# EAGLE board CSv2_exp_board (EAGLE 9.6.2)
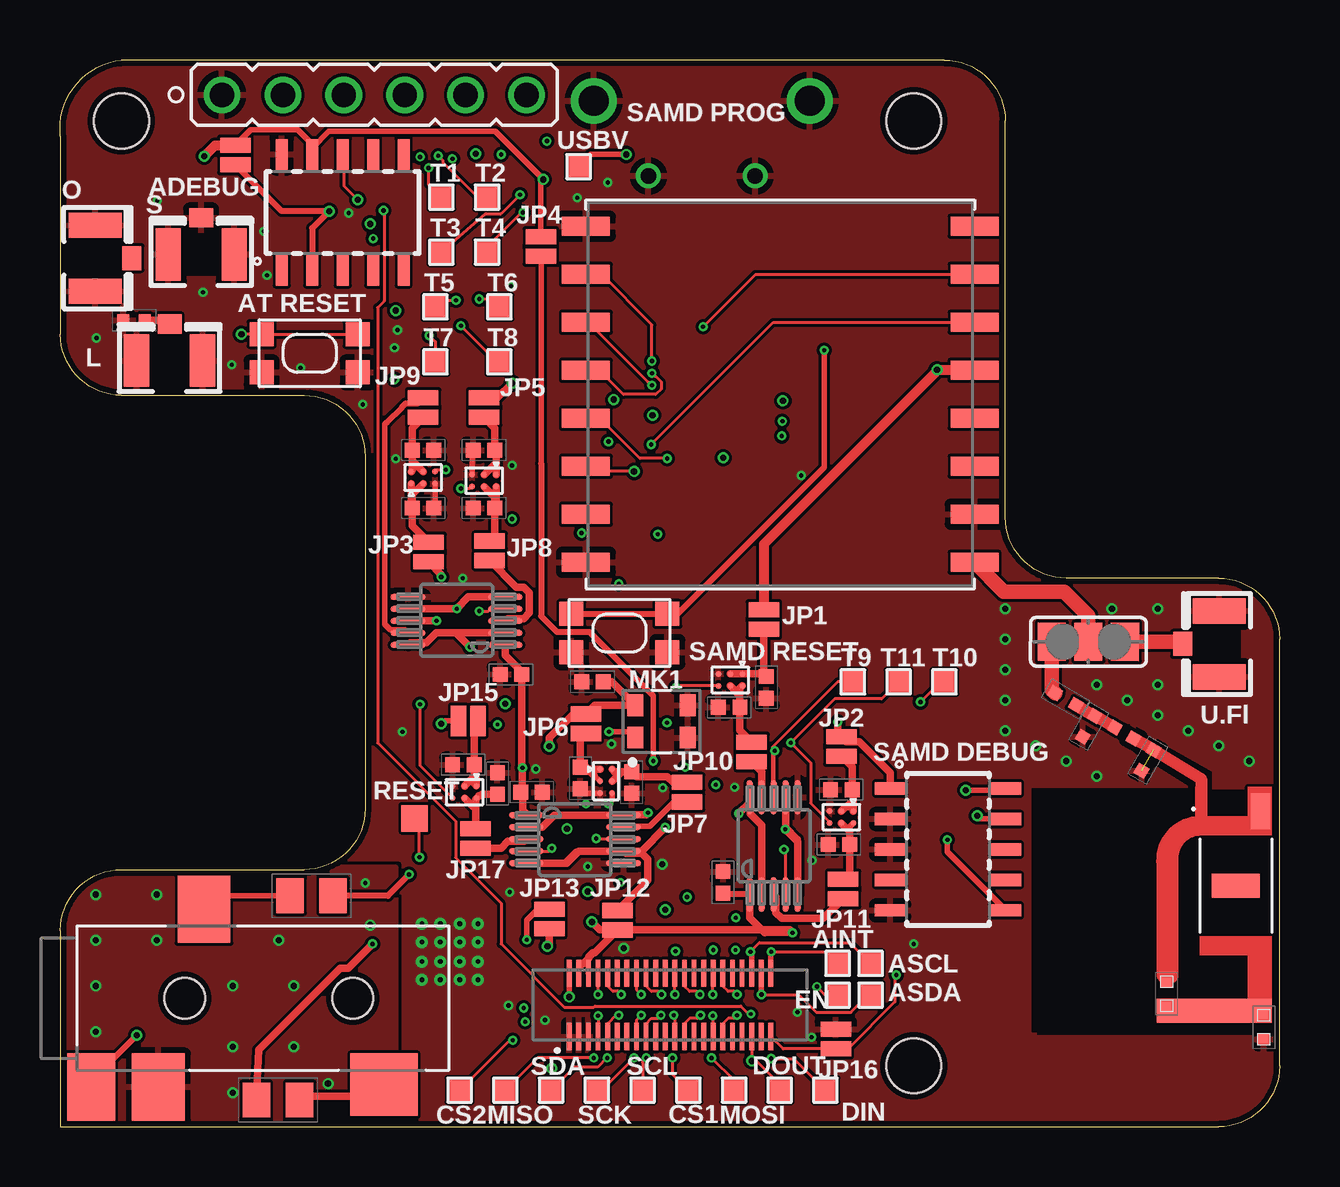
[diagram p4: board, top side]
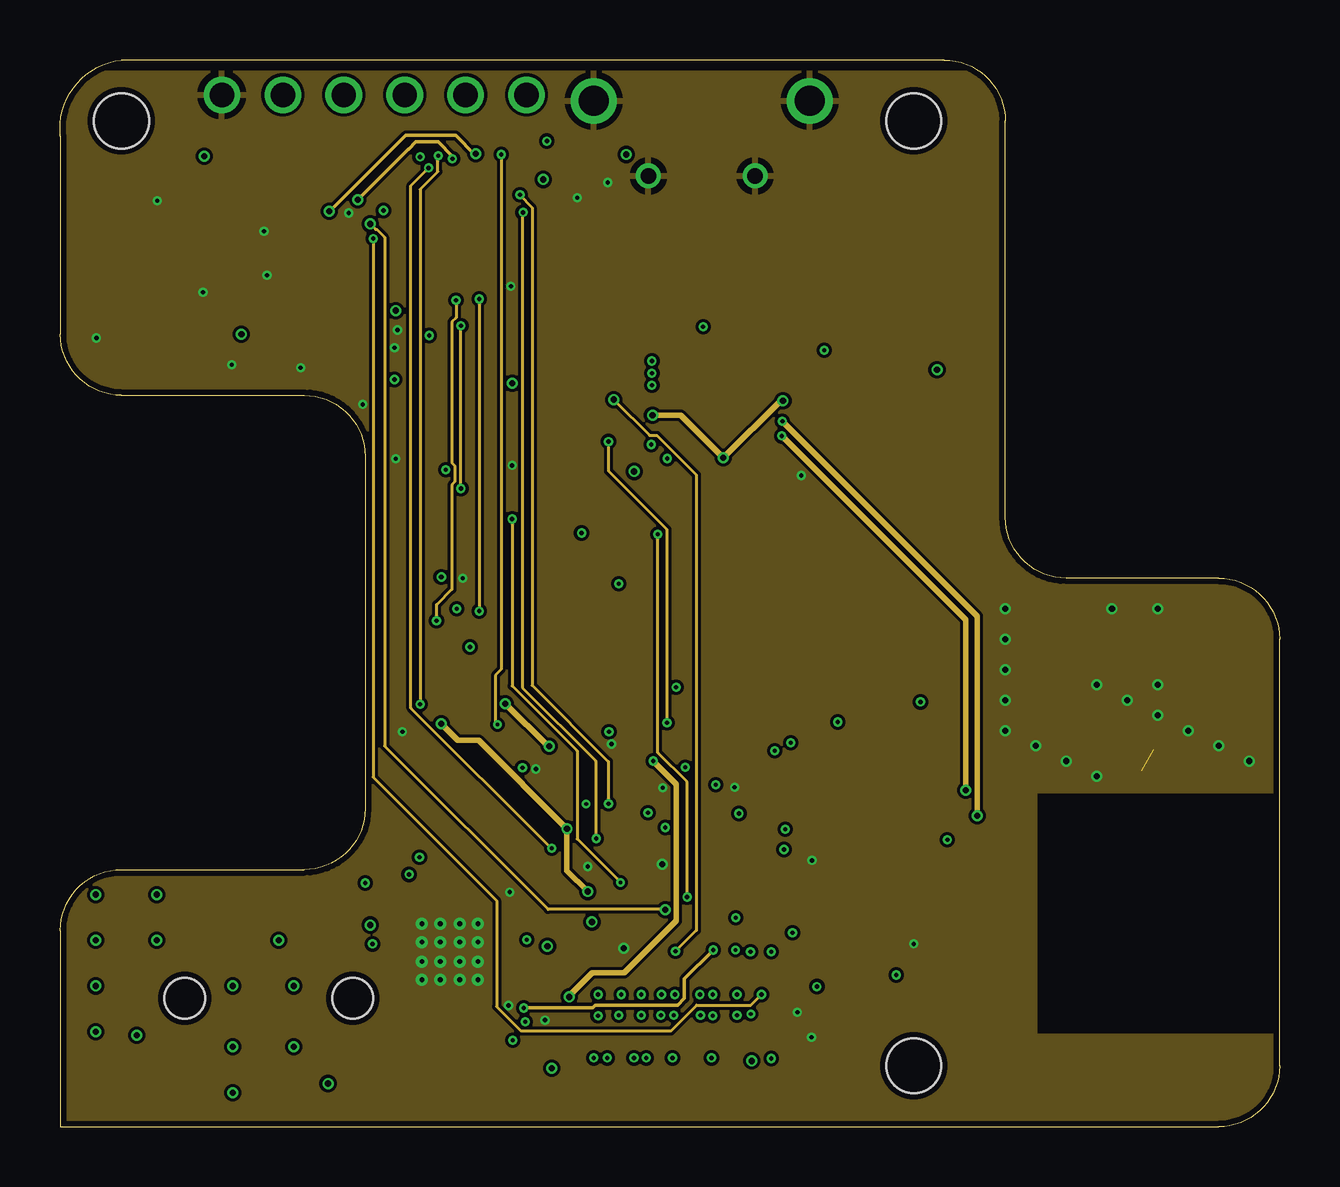
[diagram p5: board, inner layer Route2]
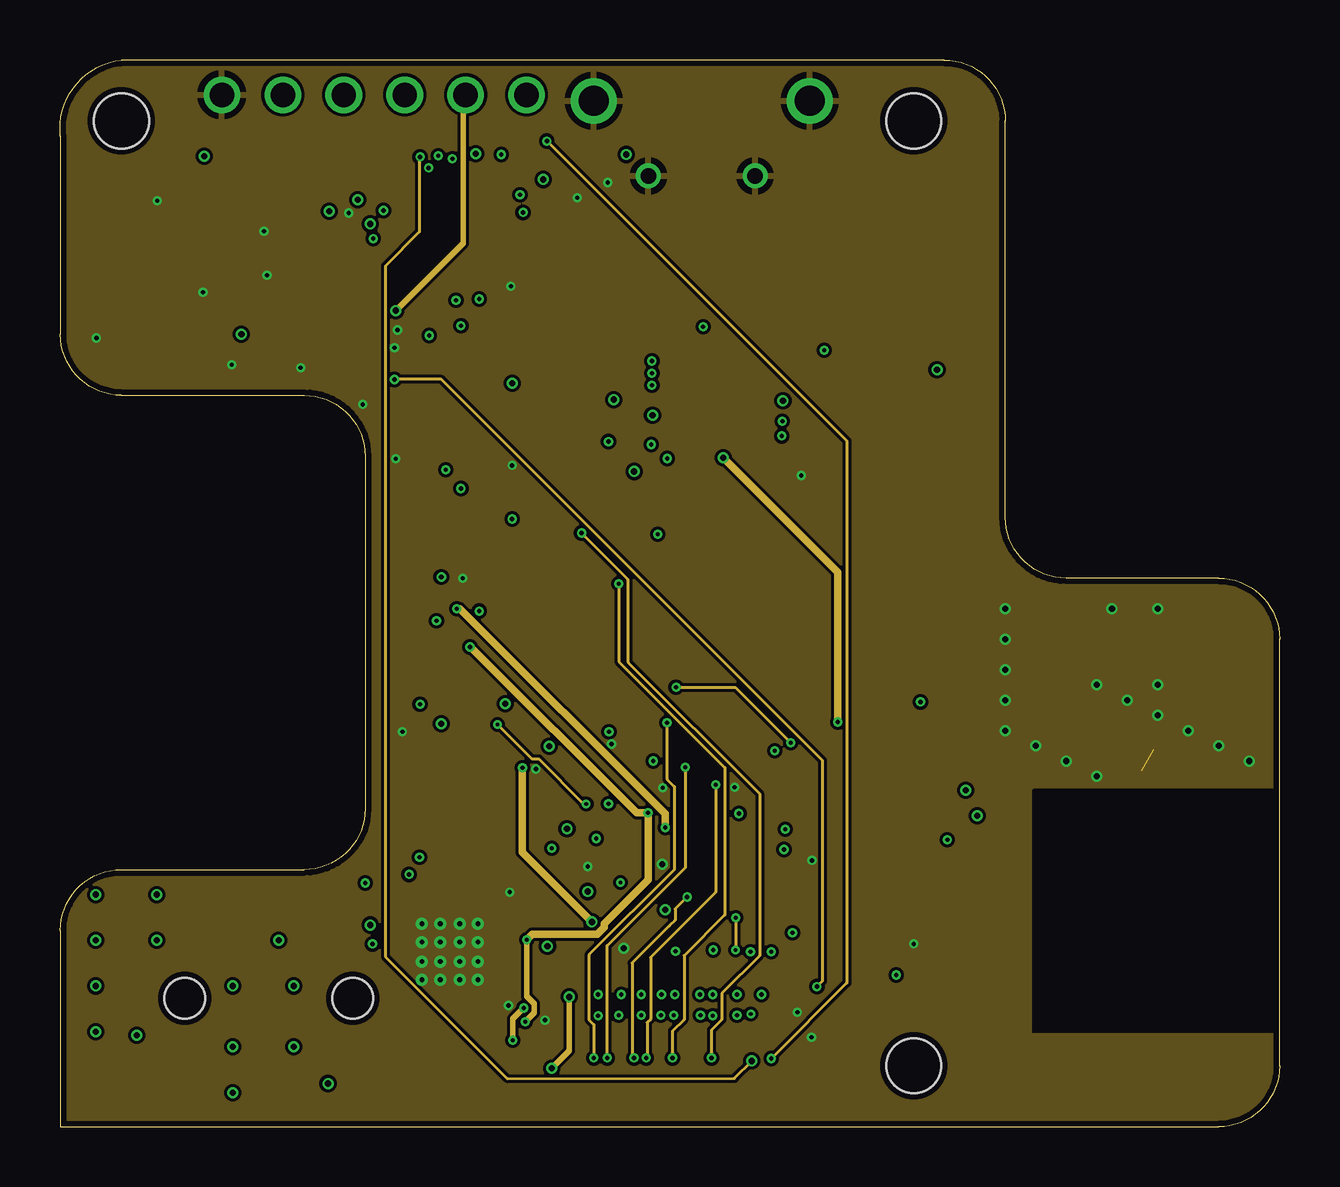
[diagram p6: board, inner layer Route15]
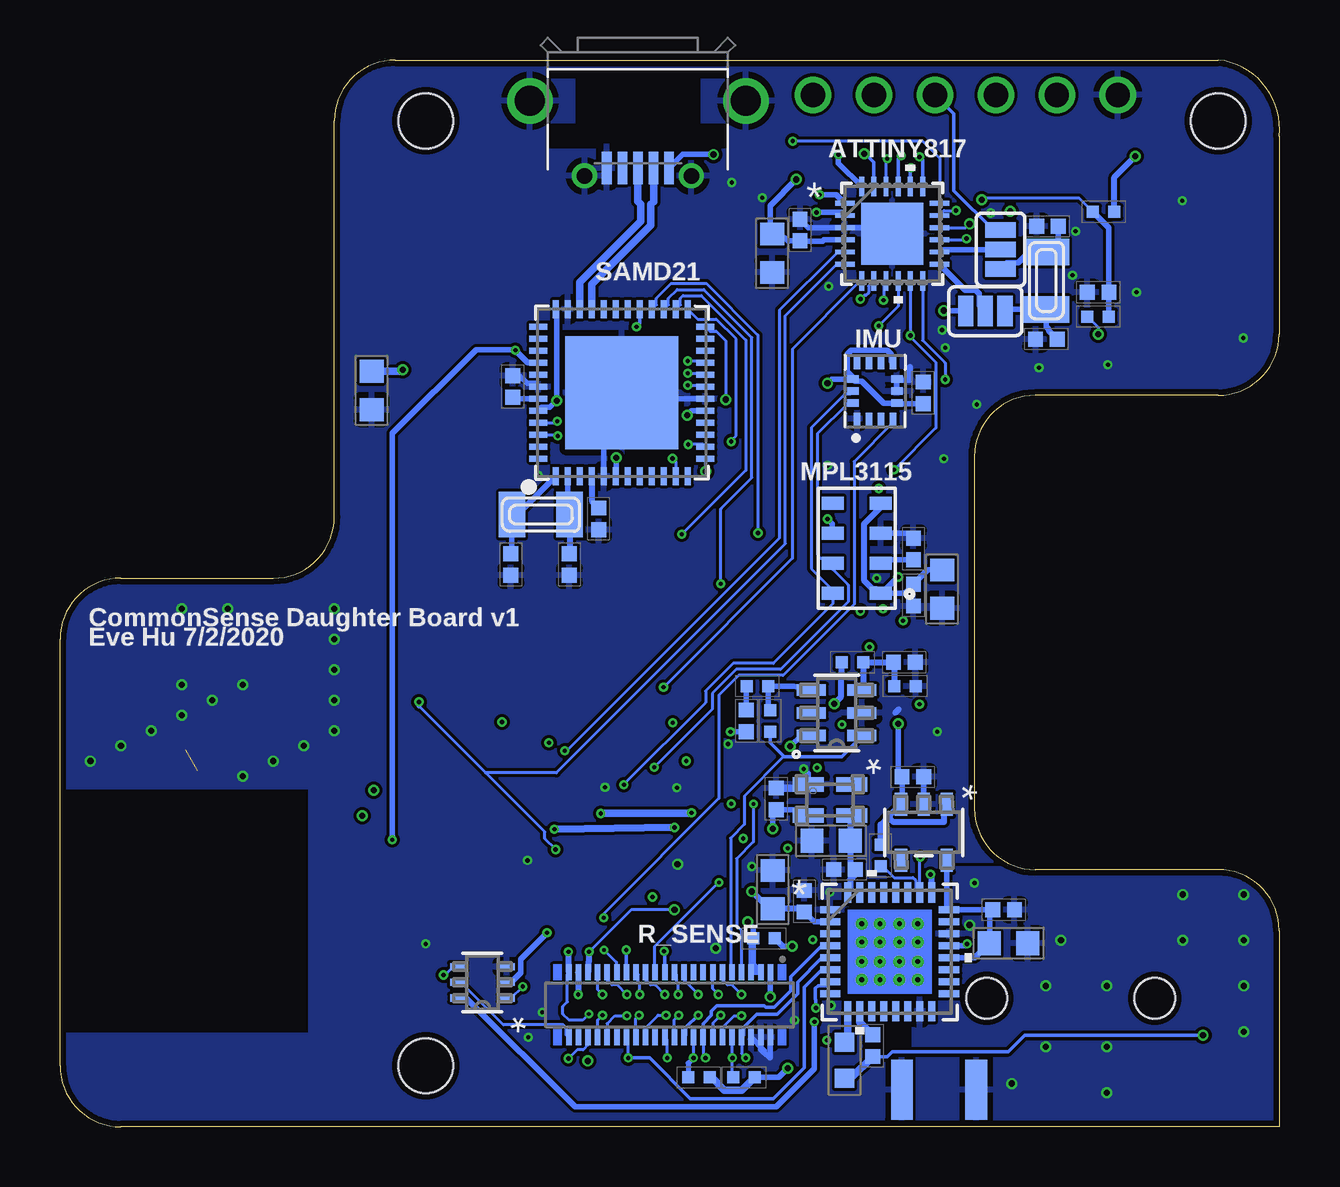
[diagram p7: board, bottom side, seen from below]

Size 50.82 x 44.45 mm. Coordinates in mm from the lower left corner, seen from the top.
Outline: 0.02,0 48.28,0 arc90 50.82,2.54 50.82,20.32 arc90 48.28,22.86 41.93,22.86 arc-90 39.39,25.4 39.39,41.91 arc90 36.85,44.45 2.56,44.45 arc90 0.02,41.27 0.02,33.02 arc90 2.56,30.48 10.18,30.48 arc-90 12.72,27.94 12.72,13.26 arc-90 10.18,10.72 2.56,10.72 arc90 0.02,8.18 0.02,0
Copper layers (1+2*15+16): Top 0.001778125mm / dielectric 0.231140625mm / Route2 0.01778125mm / dielectric 0.929640625mm / Route15 0.01778125mm / dielectric 0.231140625mm / Bottom 0.01778125mm
Design rules "CSv2_bittele_4-layer *": minimum track width 4mil, minimum drill 6mil, track to track 4mil, track to pad 4mil, pad to pad 4mil, via to via 4mil, smd to smd 4mil, copper to edge 10mil, drill to drill 5mil, minimum pad ring 4mil, minimum via ring 4mil, stop-mask expansion 4mil, vias tented up to drill 0mil, thermal gap 10mil
Net classes: 0 default: width 0.127 mm, drill 0.152 mm, clearance 0.127 mm; 1 power: width 0.229 mm, drill 0.178 mm, clearance 0.127 mm; 2 diff_pair: width 0.229 mm; 3 12mil: width 0.305 mm, drill 0.33 mm; 8 GND: width 0.127 mm
Holes 2.29 mm at 35.58,2.54 2.56,41.91 35.58,41.91

## Footprints (pad centres in the part's own frame; a part is rotated, then mirrored left to right if it is on the bottom)
ILA_09_CHIP_ANTENNA = smd 1.5 x 0.8: G1 -3.11,1.02 | smd 1 x 4.8: G2 5.2,-0.9 | smd 1 x 2: NC 0,0
TP10SQ = smd 1 x 1: TP 0,0
C0402 = smd 0.62 x 0.62: 1 -0.45,0; 2 0.45,0
C0402-S = smd 0.5 x 0.5: 1 -0.5,0; 2 0.5,0
C0603 = smd 0.95 x 1: 1 -0.8,0; 2 0.8,0
C0805 = smd 1.15 x 1.45: 1 -0.9,0; 2 0.9,0
HRS_DF40HC(3.0)-44DS-0.4V(51) = smd 0.2 x 1.14: 1 -4.2,-1.32; 2 -4.2,1.32; 3 -3.8,-1.32; 4 -3.8,1.32; 5 -3.4,-1.32; 6 -3.4,1.32; 7 -3,-1.32; 8 -3,1.32; 9 -2.6,-1.32; 10 -2.6,1.32; 11 -2.2,-1.32; 12 -2.2,1.32; 13 -1.8,-1.32; 14 -1.8,1.32; 15 -1.4,-1.32; 16 -1.4,1.32; 17 -1,-1.32; 18 -1,1.32; 19 -0.6,-1.32; 20 -0.6,1.32; 21 -0.2,-1.32; 22 -0.2,1.32; 23 0.2,-1.32; 24 0.2,1.32; 25 0.6,-1.32; 26 0.6,1.32; 27 1,-1.32; 28 1,1.32; 29 1.4,-1.32; 30 1.4,1.32; 31 1.8,-1.32; 32 1.8,1.32; 33 2.2,-1.32; 34 2.2,1.32; 35 2.6,-1.32; 36 2.6,1.32; 37 3,-1.32; 38 3,1.32; 39 3.4,-1.32; 40 3.4,1.32; 41 3.8,-1.32; 42 3.8,1.32; 43 4.2,-1.32; 44 4.2,1.32
HEADER-1X6 = drill 1.016: 1 0,-6.35; 2 0,-3.81; 3 0,-1.27; 4 0,1.27; 5 0,3.81; 6 0,6.35
SAMTECH_FTSH-105-01 = smd 0.508 x 1.27: 1 -2.54,-2.413; 2 -2.54,2.413; 3 -1.27,-2.413; 4 -1.27,2.413; 5 0,-2.413; 6 0,2.413; 7 1.27,-2.413; 8 1.27,2.413; 9 2.54,-2.413; 10 2.54,2.413
CUI_SJ-43514-SMT-TEMP = smd 2 x 2.8: 1 -7.15,-3.7 | smd 2.8 x 2.6: 2 5.05,-3.6 | smd 2.2 x 2.8: 3 -2.45,3.7; 4 -4.35,-3.7 | hole 1.7: -3.25,0; 3.75,0
HRS_DF40C-44DP-0.4V(51) = smd 0.23 x 0.66: 1 -4.2,1.355; 2 -4.2,-1.355; 3 -3.8,1.355; 4 -3.8,-1.355; 5 -3.4,1.355; 6 -3.4,-1.355; 7 -3,1.355; 8 -3,-1.355; 9 -2.6,1.355; 10 -2.6,-1.355; 11 -2.2,1.355; 12 -2.2,-1.355; 13 -1.8,1.355; 14 -1.8,-1.355; 15 -1.4,1.355; 16 -1.4,-1.355; 17 -1,1.355; 18 -1,-1.355; 19 -0.6,1.355; 20 -0.6,-1.355; 21 -0.2,1.355; 22 -0.2,-1.355; 23 0.2,1.355; 24 0.2,-1.355; 25 0.6,1.355; 26 0.6,-1.355; 27 1,1.355; 28 1,-1.355; 29 1.4,1.355; 30 1.4,-1.355; 31 1.8,1.355; 32 1.8,-1.355; 33 2.2,1.355; 34 2.2,-1.355; 35 2.6,1.355; 36 2.6,-1.355; 37 3,1.355; 38 3,-1.355; 39 3.4,1.355; 40 3.4,-1.355; 41 3.8,1.355; 42 3.8,-1.355; 43 4.2,1.355; 44 4.2,-1.355
USB-THRU-ZX62D-AB-5P8 = smd 1.35 x 0.4: D+ 2.8,0; D- 2.8,0.65; GND 2.8,-1.3; USBID 2.8,-0.65; VBUS 2.8,1.3 | drill 1.25 pad 1.9: S1 0,-4.5; S2 0,4.5 | drill 0.65 pad 1.05: S3 3.125,2.225; S4 3.125,-2.225
SMT-JUMPER_2_NC_PASTE_NO-SILK = smd 0.635 x 1.27: 1 -0.406,0; 2 0.406,0
SMT-JUMPER_2_NO_PASTEFREE_NO-SILK = smd 0.635 x 1.27: 1 -0.406,0; 2 0.406,0
L0402 = smd 0.5 x 0.5: 1 -0.45,0; 2 0.45,0
MIC_SPW2430HR5H-B = smd 0.9 x 0.66: 1 -0.675,1.095; 2 -0.675,-1.095; 3 0.675,-1.095; 4 0.675,1.095
R0402 = smd 0.5 x 0.5: 1 -0.45,0; 2 0.45,0
R0603 = smd 0.8 x 0.8: 1 -0.75,0; 2 0.75,0
R1210 = smd 0.9 x 2.5: 1 -1.55,0; 2 1.55,0
TP11SQ = smd 1.1 x 1.1: TP 0,0
SMT-JUMPER_3_1-NC_PASTE_SILK = smd 0.635 x 1.27: 1 -0.813,0; 2 0,0; 3 0.813,0
JUMPER_SJ_2 = smd 1.168 x 1.6: 1 -1.524,0; 2 0,0; 3 1.524,0
KMR2 = smd 1 x 1: 1 2,0.8; 2 2,-0.8; 3 -2,0.8; 4 -2,-0.8
WLCSP6_2X3 = smd 0.254 x 0.254: A1 -0.25,0.5; A2 0.25,0.5; B1 -0.25,0; B2 0.25,0; C1 -0.25,-0.5; C2 0.25,-0.5
RJ_6-L = smd 1.206 x 0.48: 1 -1.049,0.95; 2 -1.049,0; 3 -1.049,-0.95; 4 1.049,-0.95; 5 1.049,0; 6 1.049,0.95
DGS0010A_L = smd 1.45 x 0.25: 1 -2.025,1; 2 -2.025,0.5; 3 -2.025,0; 4 -2.025,-0.5; 5 -2.025,-1; 6 2.025,-1; 7 2.025,-0.5; 8 2.025,0; 9 2.025,0.5; 10 2.025,1
RFM-MOD = smd 2 x 0.8: 1P 8.1,-7; 2P 8.1,-5; 3P 8.1,-3; 4P 8.1,-1; 5P 8.1,1; 6P 8.1,3; 7P 8.1,5; 8P 8.1,7; 9P -8.1,7; 10P -8.1,5; 11P -8.1,3; 12P -8.1,1; 13P -8.1,-1; 14P -8.1,-3; 15P -8.1,-5; 16P -8.1,-7
PQFN50P300X250X88-14N = smd 0.5 x 0.3: 1 -1.165,0.75; 2 -1.165,0.25; 3 -1.165,-0.25; 4 -1.165,-0.75; 8 1.165,-0.75; 9 1.165,-0.25; 10 1.165,0.25; 11 1.165,0.75 | smd 0.3 x 0.5: 5 -0.5,-0.915; 6 0,-0.915; 7 0.5,-0.915; 12 0.5,0.915; 13 0,0.915; 14 -0.5,0.915
RHB32_3P45X3P45 = smd 0.85 x 0.28: 1 -2.475,1.75; 2 -2.475,1.25; 3 -2.475,0.75; 4 -2.475,0.25; 5 -2.475,-0.25; 6 -2.475,-0.75; 7 -2.475,-1.25; 8 -2.475,-1.75; 17 2.475,-1.75; 18 2.475,-1.25; 19 2.475,-0.75; 20 2.475,-0.25; 21 2.475,0.25; 22 2.475,0.75; 23 2.475,1.25; 24 2.475,1.75 | smd 0.28 x 0.85: 9 -1.75,-2.475; 10 -1.25,-2.475; 11 -0.75,-2.475; 12 -0.25,-2.475; 13 0.25,-2.475; 14 0.75,-2.475; 15 1.25,-2.475; 16 1.75,-2.475; 25 1.75,2.475; 26 1.25,2.475; 27 0.75,2.475; 28 0.25,2.475; 29 -0.25,2.475; 30 -0.75,2.475; 31 -1.25,2.475; 32 -1.75,2.475 | drill 0.2 pad 0.5: V -1.168,-1.168; V_1 -1.168,-0.406; V_2 -1.168,0.406; V_3 -1.168,1.168; V_4 -0.406,-1.168; V_5 -0.406,-0.406; V_6 -0.406,0.406; V_7 -0.406,1.168; V_8 0.406,-1.168; V_9 0.406,-0.406; V_10 0.406,0.406; V_11 0.406,1.168; V_12 1.168,-1.168; V_13 1.168,-0.406; V_14 1.168,0.406; V_15 1.168,1.168
KS_6_ADI-L = smd 0.673 x 0.305: 1 -1.01,0.65; 2 -1.01,0; 3 -1.01,-0.65; 4 1.01,-0.65; 5 1.01,0; 6 1.01,0.65
MF05A_TEX-L = smd 0.965 x 0.508: 1 -1.168,0.953; 2 -1.168,0; 3 -1.168,-0.953; 4 1.168,-0.953; 5 1.168,0.953
SC-82AB_ONS-L = smd 0.61 x 1.295: 1 -0.65,-0.902; 2 0.65,-0.902; 3 0.65,0.902; 4 -0.65,0.902
ATTINY817-MFRQFN24_RX4MC-L_QFN24_4X4MC = smd 0.813 x 0.203: 1 -1.968,1.27; 2 -1.968,0.762; 3 -1.968,0.254; 4 -1.968,-0.254; 5 -1.968,-0.762; 6 -1.968,-1.27; 13 1.968,-1.27; 14 1.968,-0.762; 15 1.968,-0.254; 16 1.968,0.254; 17 1.968,0.762; 18 1.968,1.27 | smd 0.203 x 0.813: 7 -1.27,-1.968; 8 -0.762,-1.968; 9 -0.254,-1.968; 10 0.254,-1.968; 11 0.762,-1.968; 12 1.27,-1.968; 19 1.27,1.968; 20 0.762,1.968; 21 0.254,1.968; 22 -0.254,1.968; 23 -0.762,1.968; 24 -1.27,1.968 | smd 2.591 x 2.591: 25 0,0
MPL3115A2_PSON125P300X500X120-8N = smd 0.9 x 0.55: 1 -1,1.875; 2 -1,0.625; 3 -1,-0.625; 4 -1,-1.875; 5 1,-1.875; 6 1,-0.625; 7 1,0.625; 8 1,1.875
MICROBUILDER_TQFN48_7MM = smd 0.25 x 0.75: 1 -2.75,-3.475; 2 -2.25,-3.475; 3 -1.75,-3.475; 4 -1.25,-3.475; 5 -0.75,-3.475; 6 -0.25,-3.475; 7 0.25,-3.475; 8 0.75,-3.475; 9 1.25,-3.475; 10 1.75,-3.475; 11 2.25,-3.475; 12 2.75,-3.475; 25 2.75,3.475; 26 2.25,3.475; 27 1.75,3.475; 28 1.25,3.475; 29 0.75,3.475; 30 0.25,3.475; 31 -0.25,3.475; 32 -0.75,3.475; 33 -1.25,3.475; 34 -1.75,3.475; 35 -2.25,3.475; 36 -2.75,3.475 | smd 0.75 x 0.25: 13 3.475,-2.75; 14 3.475,-2.25; 15 3.475,-1.75; 16 3.475,-1.25; 17 3.475,-0.75; 18 3.475,-0.25; 19 3.475,0.25; 20 3.475,0.75; 21 3.475,1.25; 22 3.475,1.75; 23 3.475,2.25; 24 3.475,2.75; 37 -3.475,2.75; 38 -3.475,2.25; 39 -3.475,1.75; 40 -3.475,1.25; 41 -3.475,0.75; 42 -3.475,0.25; 43 -3.475,-0.25; 44 -3.475,-0.75; 45 -3.475,-1.25; 46 -3.475,-1.75; 47 -3.475,-2.25; 48 -3.475,-2.75 | smd 4.7 x 4.7: THERMAL 0,0
ADAFRUIT2_XTAL3215 = smd 1.1 x 1.9: P$1 1.2,0; P$2 -1.2,0
U.FL = smd 2.2 x 1.05: 1 0,1.375; 2 0,-1.375 | smd 0.8 x 1: 3 1.525,0

## Placement (x,y rotation side)
A1  ILA09_CHIP_ANTENNA  [ILA_09_CHIP_ANTENNA]  49,10.04 270 top
AINT  TPTP10SQ  [TP10SQ]  32.4,6.81 0 top
ASCL  TPTP10SQ  [TP10SQ]  33.77,6.81 0 top
ASDA  TPTP10SQ  [TP10SQ]  33.77,5.49 0 top
C1  1u  [C0402]  31.95,30.84 90 bottom
C2  5.5p  [C0402]  32.03,23.43 270 bottom
C3  3.9p  [C0402-S]  50.17,4.15 90 top
C4  5.5p  [C0402]  29.59,23.43 270 bottom
C5  2.2p  [C0402-S]  46.1,5.54 270 top
C6  0.68u  [C0402]  22.22,16.92 90 bottom
C7  0.1u  [C0402]  22.19,18.54 180 top
C8  1u  [C0402]  15.64,19.35 0 bottom
C9  10u  [C0603]  37.84,30.68 270 bottom
C10  1u  [C0402]  32.45,11.76 180 top
C11  0.1u  [C0402]  32.55,14.05 180 top
C12  4.7u  [C0603]  21.15,36.4 90 bottom
C13  0.1u  [C0402]  19.98,37.36 270 bottom
C14  1u  [C0402]  28.37,25.33 270 bottom
C15  13pF  [C0402]  9.67,37.52 0 bottom
C16  13pF  [C0402]  9.72,32.82 0 bottom
C17  1u  [C0402]  27.88,17.48 180 top
C18  0.1u  [C0402]  29.43,18.31 270 top
C19  1u  [C0402]  15.13,28.19 0 top
C20  0.1u  [C0402]  15.13,25.78 0 top
C21  1u  [C0402]  17.67,25.78 180 top
C22  0.1u  [C0402]  17.67,28.19 180 top
C23  1u  [C0402]  23.82,14.35 270 top
C24  0.1u  [C0402]  21.68,14.53 270 top
C25  0.1u  [C0402]  14.85,30.58 90 bottom
C26  22p  [C0402-S]  41.89,17.82 330 top
C29  1u  [C0402]  18.23,14.3 90 top
C30  0.1u  [C0402]  16.81,15.09 180 top
C31  47u  [C0805]  9.08,1.12 0 top
C32  47u  [C0805]  10.48,9.63 180 top
C33  0.1u  [C0402]  16.96,3.38 270 bottom
C34  0.1u  [C0402]  19.8,9.4 90 bottom
C35  10u  [C0603]  21.12,9.88 90 bottom
C36  0.1u  [C0402]  11.5,9.04 0 bottom
C37  10u  [C0603]  11.29,7.65 0 bottom
C38  0.1u  [C0402]  18.13,10.72 180 bottom
C39  10u  [C0603]  18.69,11.91 180 bottom
C40  10u  [C0603]  14.06,22.4 90 bottom
C41  2.2u  [C0402]  15.28,14.58 0 bottom
C42  1u  [C0402]  20.97,13.67 90 bottom
C43  0.1u  [C0402]  19.65,13.94 0 top
C44  0.1u  [C0402]  18.79,18.85 180 top
C45  0.1u  [C0402]  27.63,10.19 90 top
C46  4.7n  [C0402]  7.56,34.77 0 bottom
C47  0.1u  [C0402]  15.26,22.15 270 bottom
C48  0.1u  [C0402]  15.26,24.08 90 bottom
CS1  TPTP10SQ  [TP10SQ]  26.18,1.52 0 top
CS2  TPTP10SQ  [TP10SQ]  16.65,1.52 0 top
DIN  TPTP10SQ  [TP10SQ]  31.89,1.52 0 top
DOUT  TPTP10SQ  [TP10SQ]  29.99,1.52 0 top
EN  TPTP10SQ  [TP10SQ]  32.4,5.49 0 top
J1  HIROSE-DF40_44-PIN_CONNECTORS-RECEPTACLE  [HRS_DF40HC(3.0)-44DS-0.4V(51)]  25.42,5.08 0 top
J2  J-SERIAL-PORT  [HEADER-1X6]  13.09,43 270 top
J3  CORTEX_DEBUG_SMD  [SAMTECH_FTSH-105-01]  37,11.56 270 top
J4  SJ-43514-SMTC  [CUI_SJ-43514-SMT-TEMP]  8.45,5.36 0 top
J5  HIROSE-DF40_44-PIN_CONNECTORS-HEADER  [HRS_DF40C-44DP-0.4V(51)]  25.42,5.08 180 bottom
J6  ATTINY_AVR_DEBUG  [SAMTECH_FTSH-105-01]  11.78,38.1 0 top
J7  J-USB-HIROSE-MICRO-USB  [USB-THRU-ZX62D-AB-5P8]  26.74,42.75 270 bottom
JP1  JUMPER-SMT_2_NC_PASTELG_NO-SILK  [SMT-JUMPER_2_NC_PASTE_NO-SILK]  29.33,21.13 90 top
JP2  JUMPER-SMT_2_NC_PASTELG_NO-SILK  [SMT-JUMPER_2_NC_PASTE_NO-SILK]  32.55,15.85 90 top
JP3  JUMPER-SMT_2_NC_PASTELG_NO-SILK  [SMT-JUMPER_2_NC_PASTE_NO-SILK]  15.36,23.95 270 top
JP4  JUMPER-SMT_2_NC_PASTELG_NO-SILK  [SMT-JUMPER_2_NC_PASTE_NO-SILK]  20.03,36.68 90 top
JP5  JUMPER-SMT_2_NC_PASTELG_NO-SILK  [SMT-JUMPER_2_NC_PASTE_NO-SILK]  17.67,29.97 90 top
JP6  JUMPER-SMT_2_NC_PASTELG_NO-SILK  [SMT-JUMPER_2_NC_PASTE_NO-SILK]  21.91,16.79 90 top
JP7  JUMPER-SMT_2_NC_PASTELG_NO-SILK  [SMT-JUMPER_2_NC_PASTE_NO-SILK]  26.13,13.94 90 top
JP8  JUMPER-SMT_2_NC_PASTELG_NO-SILK  [SMT-JUMPER_2_NC_PASTE_NO-SILK]  17.9,24 90 top
JP9  JUMPER-SMT_2_NC_PASTELG_NO-SILK  [SMT-JUMPER_2_NC_PASTE_NO-SILK]  15.13,29.97 270 top
JP10  JUMPER-SMT_2_NC_PASTELG_NO-SILK  [SMT-JUMPER_2_NC_PASTE_NO-SILK]  28.82,15.62 90 top
JP11  JUMPER-SMT_2_NC_PASTELG_NO-SILK  [SMT-JUMPER_2_NC_PASTE_NO-SILK]  32.63,9.91 90 top
JP12  JUMPER-SMT_2_NC_PASTELG_NO-SILK  [SMT-JUMPER_2_NC_PASTE_NO-SILK]  23.23,8.61 90 top
JP13  JUMPER-SMT_2_NC_PASTELG_NO-SILK  [SMT-JUMPER_2_NC_PASTE_NO-SILK]  20.39,8.66 90 top
JP14  JUMPER-SMT_2_NO_PASTEFREE  [SMT-JUMPER_2_NO_PASTEFREE_NO-SILK]  7.31,40.49 270 top
JP15  JUMPER-SMT_2_NC_PASTELG_NO-SILK  [SMT-JUMPER_2_NC_PASTE_NO-SILK]  17.01,16.92 180 top
JP16  JUMPER-SMT_2_NO_PASTEFREE  [SMT-JUMPER_2_NO_PASTEFREE_NO-SILK]  32.33,3.66 270 top
JP17  JUMPER-SMT_2_NC_PASTELG_NO-SILK  [SMT-JUMPER_2_NC_PASTE_NO-SILK]  17.31,12.01 90 top
L1  1.2n  [L0402]  44.34,16.41 330 top
MISO  TPTP10SQ  [TP10SQ]  18.56,1.52 0 top
MK1  SPW2430HR5H-B  [MIC_SPW2430HR5H-B]  25.06,16.89 90 top
MOSI  TPTP10SQ  [TP10SQ]  28.08,1.52 0 top
R1  4.99k  [R0402]  21.76,18.36 180 bottom
R2  82.5k  [R0402]  21.23,16.92 90 bottom
R3  100k  [R0402]  15.61,18.36 0 bottom
R4  100k  [R0402]  17.8,19.35 0 bottom
R5  4.7k  [R0402]  22.32,2.06 180 bottom
R6  4.7k  [R0402]  24.2,2.06 180 bottom
R7  50R  [R0402]  3.09,33.6 180 top
R8  2.2k  [R0603]  18.13,2.77 270 bottom
R9  39R  [R0402]  7.56,33.76 0 bottom
R10  100k  [R0402]  7.33,38.13 0 bottom
R11  100k  [R0402]  16.63,11.3 90 bottom
R12  0R  [R1210]  14.19,1.55 180 bottom
R27  0R  [C0402-S]  42.86,16.69 240 top
R28  0R  [C0402-S]  45.32,15.27 240 top
R_SENSE  1.33R  [R0402]  21.48,7.85 0 bottom
RESET  TPTP11SQ  [TP11SQ]  14.77,12.85 0 top
SCK  TPTP10SQ  [TP10SQ]  22.37,1.52 0 top
SCL  TPTP10SQ  [TP10SQ]  24.27,1.52 0 top
SDA  TPTP10SQ  [TP10SQ]  20.46,1.52 0 top
SJ1  JUMPER-SMT_3_1-NC_PASTE_SILK  [SMT-JUMPER_3_1-NC_PASTE_SILK]  12.26,33.99 180 bottom
SJ2  JUMPER-SMT_3_1-NC_PASTE_SILK  [SMT-JUMPER_3_1-NC_PASTE_SILK]  11.62,36.55 90 bottom
SJ3  [JUMPER_SJ_2]  42.85,20.21 359.9 top
SW1  SPST_TACT-KMR2  [KMR2]  10.41,32.23 180 top
SW2  SPST_TACT-KMR2  [KMR2]  23.31,20.57 180 top
T1  TPTP10SQ  [TP10SQ]  15.89,38.73 0 top
T2  TPTP10SQ  [TP10SQ]  17.8,38.73 0 top
T3  TPTP10SQ  [TP10SQ]  15.89,36.45 0 top
T4  TPTP10SQ  [TP10SQ]  17.8,36.45 0 top
T5  TPTP10SQ  [TP10SQ]  15.64,34.16 0 top
T6  TPTP10SQ  [TP10SQ]  18.31,34.16 0 top
T7  TPTP10SQ  [TP10SQ]  15.64,31.88 0 top
T8  TPTP10SQ  [TP10SQ]  18.31,31.88 0 top
T9  TPTP10SQ  [TP10SQ]  33.04,18.54 0 top
T10  TPTP10SQ  [TP10SQ]  36.85,18.54 0 top
T11  TPTP10SQ  [TP10SQ]  34.94,18.54 0 top
U1  LOADSWITCH-MIC94164  [WLCSP6_2X3]  32.55,12.9 270 top
U2  ADA4841-1YRJZ-R7RJ_6-L  [RJ_6-L]  18.46,17.25 180 bottom
U3  Value  [DGS0010A_L]  21.45,11.99 0 top
U4  RFM69HCW  [RFM-MOD]  30.01,30.52 0 top
U5  Value  [DGS0010A_L]  16.53,21.08 180 top
U6  Value  [DGS0010A_L]  29.74,11.71 90 top
U7  LOADSWITCH-MIC94164  [WLCSP6_2X3]  27.93,18.62 270 top
U8  LOADSWITCH-MIC94164  [WLCSP6_2X3]  15.13,27.05 90 top
U9  LOADSWITCH-MIC94164  [WLCSP6_2X3]  17.67,26.92 270 top
U10  LOADSWITCH-MIC94164  [WLCSP6_2X3]  22.75,14.4 0 top
U11  BMI160  [PQFN50P300X250X88-14N]  16.86,30.66 90 bottom
U12  TLV320DAC26IRHB  [RHB32_3P45X3P45]  16.25,7.29 0 bottom
U13  ADG839YKSZ-500RL7KS_6_ADI-L  [KS_6_ADI-L]  33.21,6.02 180 bottom
U14  LOADSWITCH-MIC94164  [WLCSP6_2X3]  16.86,13.94 270 top
U15  LP2980AIM5-2.5/NOPBMF05A_TEX-L  [MF05A_TEX-L]  14.83,12.27 270 bottom
U16  NCP553SQ18T1GSC-82AB_ONS-L  [SC-82AB_ONS-L]  18.74,13.61 270 bottom
U17  ATTINY817-MFRQFN24_RX4MC-L_ATTINY817-MFR  [ATTINY817-MFRQFN24_RX4MC-L_QFN24_4X4MC]  16.15,37.21 0 bottom
U18  MPL3115A2  [MPL3115A2_PSON125P300X500X120-8N]  17.62,24.1 180 bottom
U19  ATSAMD21G18_QFN  [MICROBUILDER_TQFN48_7MM]  27.41,30.59 0 bottom
USBV  TPTP10SQ  [TP10SQ]  21.61,40.01 0 top
X1  32.768kHz  [ADAFRUIT2_XTAL3215]  9.72,35.26 270 bottom
X2  32.768kHz  [ADAFRUIT2_XTAL3215]  30.78,25.51 180 bottom
X3  uFL  [U.FL]  1.46,36.2 0 top
X4  uFL  [U.FL]  48.3,20.12 180 top
X5  uFL  [U.FL]  5.88,36.35 90 top
X6  uFL  [U.FL]  4.56,31.93 90 top

## Tracks (layer width: path | path; a pad name or v marks a point on that pad's centre or on a via)
+1V8_CODEC
  Bottom 0.254: U16.3 17.89,12.91 C39.1 17.89,10.93 C38.1 17.68,10.51 17.89,10.29 17.89,9.87 U12.32
+3V3_ATT  (via drill 0.25)
  Top 0.229: JP14.1 7.96,41.54 9.91,41.54 10.51,40.95 J6.4 10.51,40.78 11.21,41.48 18.13,41.48 v20.13,39.47 20.03,39.47 JP4.2
  Top 0.406: v6.01,40.44 6.47,40.89 JP14.1
  Bottom 0.229: U17.4 18.99,36.96 19.04,36.91 C13.2 20.5,36.91 20.79,37.2 C12.2 21.23,37.27 21.23,38.38 v20.13,39.47
  Bottom 0.254: R10.2 6.88,39.57 v6.01,40.44
+3V3_BARO  (via drill 0.2)
  Top 0.305: v15.89,22.91 15.89,23.01 JP3.2
  Bottom 0.229: v15.89,22.91 16.57,22.23 U18.1 15.69,22.23 15.67,22.25 15.61,22.25 C47.1 14.65,23.2 C40.2
  Bottom 0.254: U18.4 16.62,25.81 17.32,25.11 17.32,22.77 16.97,22.42 16.81,22.42 U18.1
+3V3_BARO_IN
  Top 0.229: U8.A2 14.63,27.7 14.68,27.75
  Top 0.305: JP9.2 14.68,29.12 C19.1 | C19.1 14.68,27.35 U8.A2 | C19.1 14.68,27.75 U8.B2
+3V3_BARO_OUT
  Top 0.305: U8.A1 14.63,25.83 C20.1 | C20.1 14.68,26.35 U8.B1 | C20.1 14.68,25.04 JP3.1
+3V3_BARO_PWR
  Top 0.229: U5.9 14.37,20.72 13.75,20.72 13.54,20.93 13.54,29.27 13.62,29.35
  Top 0.254: JP9.1 14.89,30.14 14.39,30.14 14.24,29.99 14.24,29.97 13.62,29.35
+3V3_CODEC  (via drill 0.25)
  Top 0.229: JP15.2 16.04,16.92 15.92,16.79 v15.89,16.79
  Route2 0.229: v21.99,9.8 21.12,10.67 v21.12,12.42 17.44,16.1 16.58,16.1 v15.89,16.79
  Bottom 0.229: U12.2 19.4,8.54 C34.1 | v21.12,12.42 21.12,13.06 C42.1 19.89,13.21 U16.2 | v21.99,9.8 21.26,9.08 C35.1 | v15.89,16.79 15.89,14.74 C41.1 15.73,13.48 U15.3
  Bottom 0.254: R11.2 16.63,12.59 16.31,12.91 | 16.31,12.91 U15.3 | U15.1 13.99,13.32 13.99,12.7 16.1,12.7 16.31,12.91 | C34.1 19.94,9.08 C35.1
+3V3_CODEC_IN
  Top 0.229: JP17.2 17.31,13.34 17.31,13.65 U14.A2
  Top 0.305: JP17.2 17.31,13.65 | U14.A2 17.45,13.79 17.53,13.79 17.59,13.85 C29.1 | 17.31,13.34 17.22,13.34 U14.B2
+3V3_CODEC_OUT
  Top 0.229: 17.26,14.61 17.26,14.29 U14.A1
  Top 0.305: U14.B1 16.86,14.21 17.26,14.61 17.35,14.52 17.35,14.22 17.26,14.31 C30.1 17.26,16.76 JP15.1
+3V3_CODEC_PWR
  Top 0.305: U3.3 19.33,11.89 18.66,11.89 18.38,11.61 JP17.1
+3V3_DTR  (via drill 0.18, 0.25)
  Top 0.229: JP12.1 22.24,7.21 22.22,7.21 22.02,7.01 | 22.02,7.01 J1.6 | J1.4 21.62,6.61 21.8,6.79 22.02,7.01 | 19.27,14.01 C43.1
  Top 0.254: 29.37,8.09 v30.52,8.09 | U6.1 27.68,9.68 C45.1
  Top 0.305: JP12.1 22.5,8.2 v22.17,8.53 | U5.1 18.55,19.65 19.24,18.96 C44.1 19.24,14.99 v19.27,14.96 19.27,14.01 | C43.1 19.28,13.87 19.28,13.19 19.43,13.04 U3.1 | JP12.1 22.28,7.25 22.2,7.25 22.04,7.09 22.04,7.03 21.8,6.79 | JP12.1 30.41,8.2 v30.52,8.09 | U6.1 28.74,8.72 29.37,8.09
  Route15 0.305: v22.17,8.53 19.27,11.43 v19.27,14.96
  Bottom 0.229: R_SENSE.1 22.02,7.76 J5.6 J5.4 21.93,6.75 R_SENSE.1 | R_SENSE.1 21.93,8.3 v22.17,8.53 | U13.2 32.2,6.03 32.01,6.03 31.63,6.42 31.63,6.99 v30.52,8.09
+3V3_DTR0  (via drill 0.18, 0.25)
  Top 0.229: v21.23,5.41 J1.2 | JP4.1 20.04,36.27 20.04,27.65 | v24.72,15.24 24.72,17.97 22.17,20.52
  Top 0.254: 22.17,20.52 22.07,20.62 20.7,20.62 20.04,21.28 20.04,27.65
  Route2 0.229: v24.72,15.24 25.68,14.28 25.68,8.59 23.51,6.41 22.18,6.41 21.23,5.46 v21.23,5.41
  Route15 0.229: v21.23,5.41 21.23,3.17 v20.49,2.44
  Bottom 0.229: R5.1 20.87,2.06 v20.49,2.44 | v21.23,5.41 21.23,6.43 J5.2 | R6.1 23.66,2.06
  Bottom 0.305: R5.1 22.4,1.53 23.13,1.53 23.66,2.06
+3V3_IMU  (via drill 0.25)
  Top 0.305: v18.84,30.99 18.23,30.38 JP5.2
  Bottom 0.229: U11.8 16.19,31.91 16.19,32.19 16.36,32.36 17.86,32.36 18.02,32.19 18.02,31.45 17.77,31.2 U11.12 | U11.12 17.69,31.07 17.4,31.07 16.49,30.16 U11.5 15.92,30.13 C25.1 | U11.12 18.67,31.16 v18.84,30.99
+3V3_IMU_IN
  Top 0.305: C21.1 18.17,25.83 U9.A2 | C21.1 18.12,26.22 U9.B2 | C21.1 18.12,24.63 JP8.2
+3V3_IMU_OUT
  Top 0.305: U9.A1 18.17,27.67 | 18.17,27.67 18.17,28.14 C22.1 18.12,29.12 JP5.1 | U9.B1 18.17,27.67
+3V3_IMU_PWR
  Top 0.305: U5.3 18.65,21.18 19.32,21.18 19.56,21.41 19.56,22.25 19.32,22.49 19.01,22.49 JP8.1
+3V3_MEAS  (via drill 0.18)
  Top 0.229: U5.10 14.64,20.22 15.25,20.22 15.62,20.58 16.53,20.58 | v19.45,7.8 19.45,8.61 19.91,9.07 JP13.2
  Top 0.305: U5.10 14.6,20.18 15.27,20.18 15.67,20.58 16.53,20.58 | 16.53,20.58 U5.2 | v17.09,19.99 16.53,20.55 16.53,20.58 | U3.2 20.09,12.48 20.6,12.99 U3.10 23.5,13.01 24.43,13.01 v24.5,13.08 | v28.29,13.06 28.74,13.5 U6.10 28.75,13.72 28.75,13.04 29.24,12.56 U6.2
  Route15 0.229: v19.45,7.8 19.45,5.44 19.75,5.13 19.75,4.75 v19.38,4.38
  Route15 0.305: v19.45,7.8 19.68,8.03 22.38,8.03 22.67,8.32 22.67,8.46 24.5,10.29 v24.5,13.08 24.03,13.08 17.12,19.99 v17.09,19.99
  Bottom 0.229: v19.38,4.38 19.38,2.41 20.97,0.83 29.35,0.83 33.86,5.33 34.16,5.33 U13.6
  Bottom 0.305: v24.5,13.08 24.53,13.06 v28.29,13.06
+3V3_MIC  (via drill 0.25)
  Top 0.305: v20.39,15.85 20.39,16.21 21.38,17.2 JP6.2 22.28,17.57 MK1.4 22.99,18.54 C7.1
  Route2 0.229: v20.39,15.85 20.34,15.85 v18.56,17.63
  Bottom 0.229: v20.39,15.85 19.94,16.3 U2.6
  Bottom 0.254: R4.1 18.25,18.71 18.27,18.69 18.27,17.92 v18.56,17.63
+3V3_MIC_IN
  Top 0.305: JP7.2 25.55,14.35 25.31,14.59 24.03,14.59 C23.1 | C23.1 23.1,14.8 U10.A2 | C23.1 23.4,14.8 U10.B2
+3V3_MIC_OUT
  Top 0.229: 22.27,14.63 U10.B1
  Top 0.305: U10.A1 21.76,14.9 C24.1 | C24.1 21.92,14.98 22.27,14.63 | C24.1 21.68,16.15 JP6.1
+3V3_MIC_PWR
  Top 0.229: JP7.1 25.6,13.54 24.58,12.52 23.51,12.52 U3.9
+3V3_NMEAS  (via drill 0.18)
  Top 0.229: U3.5 19.7,10.99 21.01,10.99 21.51,11.49 21.61,11.49 | U5.7 v16.52,21.59 | U5.5 17.02,22.08 v16.52,21.59 | JP12.2 24.45,10.23 24.45,11.14 24.23,11.36 24.22,11.36 24.09,11.49 | 24.09,11.49 23.51,11.49 U3.7 | v16.53,21.59 v16.52,21.59 | 24.23,11.49 24.09,11.49
  Top 0.254: U6.5 30.74,11.99 30.24,12.5 U6.7
  Top 0.305: U5.7 v16.52,21.58 v16.53,21.59 17.02,22.08 U5.5 | v25.21,12.47 24.23,11.49 23.51,11.49 | 19.7,10.99 21.11,10.99 21.61,11.49 U3.7 23.58,11.39 24.25,11.39 24.48,11.16 24.48,10.27 JP12.2 | U6.7 30.24,12.41 v30.22,12.39 30.74,11.88 U6.5
  Route15 0.305: v16.53,21.59 16.66,21.59 25.21,13.03 v25.21,12.47
  Bottom 0.305: v25.21,12.47 v30.22,12.39
+3V3_RFM  (via drill 0.25)
  Top 0.406: JP1.2 29.33,24.28 36.54,31.5 v36.54,31.55 36.57,31.52 U4.5P
  Bottom 0.305: C9.1 36.61,31.48 v36.54,31.55
+3V3_RFM_IN
  Top 0.254: 28.33,17.97 28.33,18.27
  Top 0.305: JP10.2 28.33,16.52 C17.1 | C17.1 28.33,18.27 U7.A2 | C17.1 28.33,17.97 U7.B2
+3V3_RFM_OUT
  Top 0.254: 29.33,18.87 U7.A1 U7.B1
  Top 0.305: U7.B1 29.33,18.87 C18.1 29.33,18.86 JP1.1
+3V3_RFM_PWR
  Top 0.305: U6.9 29.24,14.8 JP10.1
+3V3_SAMD  (via drill 0.18, 0.25)
  Top 0.305: v32.4,16.87 32.4,16.26 JP2.2 32.77,16.04 33.31,16.04 34.59,14.76 J3.1
  Route2 0.229: v24.69,29.65 25.86,29.65 v27.64,27.87 30.02,30.26 v30.12,30.26
  Route15 0.305: v32.4,16.87 32.4,23.11 v27.64,27.87
  Bottom 0.229: U19.44 30.75,29.97 30.41,29.97 30.1,30.28 v30.12,30.26 30.12,34.03 U19.36 | v24.69,29.65 24.5,29.84 U19.17 | v27.64,27.87 27.64,27.14 U19.6
+3V3_SAMD_IN
  Top 0.254: JP11.2 32.73,10.31 32.81,10.39 | 32.9,12.3 32.9,12.5 U1.A2
  Top 0.305: U1.B2 32.9,12.3 C10.1 32.9,10.49 32.81,10.39
+3V3_SAMD_OUT
  Top 0.254: C11.1 33,13.6 U1.B1
  Top 0.305: JP2.1 33,14.99 C11.1 33.05,14 33.05,13.34 | U1.A1 33.05,13.34 | U1.B1 32.74,13.34 33.05,13.34
+3V3_SAMD_PWR
  Top 0.305: U6.3 29.83,9.59 29.83,8.92 30.07,8.68 31.81,8.68 JP11.1
+3V_CODEC_A
  Bottom 0.229: U15.5 13.87,9.14 U12.24 13.76,9.05 C36.1 12.08,8.91 12.08,7.63 C37.1 12.7,7.04 U12.20
AGND  (via drill 0.18, 0.25)
  other vias: 12.92,8.41 9.75,5.87 1.49,9.68 4.03,9.68 1.49,7.77 1.49,5.87 1.49,3.96 4.03,7.77 7.21,5.87 9.11,7.77 7.21,3.33 9.75,3.33 7.21,1.42 11.17,1.8 12.72,10.16
  pour Bottom: 0.02,10.79 0.02,0 15.26,0 15.26,10.79
  pour Top: 0.02,10.79 0.02,-0.64 13.99,-0.64 13.99,10.79
AREF
  Bottom 0.254: U19.4 28.66,26.07 C14.1
AT_RESET  (via drill 0.18, 0.25)
  Top 0.127: v12.41,38.63 11.83,39.22 11.83,40.46 J6.6
  Route2 0.152: v16.35,40.34 v16.34,40.35 16.34,40.45 15.75,41.03 14.82,41.03 14.52,40.74 v12.41,38.63
  Bottom 0.127: R10.1 8.37,38.71 12.34,38.71 v12.41,38.63 | U17.22 16.4,40.28 v16.35,40.34
  Bottom 0.229: R9.2 C46.2 7.11,37.45 R10.1
AT_UPDI  (via drill 0.25)
  Top 0.254: J6.3 10.51,37.44 v11.22,38.15 9.24,38.15 JP14.2
  Route2 0.152: v11.22,38.15 11.25,38.15 14.41,41.31 16.49,41.31 17.29,40.51 v17.31,40.54
  Bottom 0.152: U17.23 16.91,40.2 17.31,40.6 v17.31,40.54
ATT_INT  (via drill 0.15, 0.18)
  Top 0.127: v29.63,7.29 31.92,7.29 AINT.TP | v13.48,38.18 13.5,38.15 13.5,34.4 13.23,34.13 13.23,16 16.49,12.74 16.49,11.21 18.38,9.32 18.38,7.62 21.01,4.99 22.25,4.99 22.29,5.03 28.37,5.03 28.7,4.7 v28.78,4.7
  Top 0.229: J1.44 29.62,7.27 v29.63,7.29
  Bottom 0.127: U17.17 13.97,38.18 v13.48,38.18 | v28.78,4.7 29.04,4.45 29.61,4.45 29.86,4.7 29.86,5.02 29.67,5.21 29.67,6.35 J5.44
  Bottom 0.254: J5.44 29.62,7.27 v29.63,7.29
BUS0_AIN0  (via drill 0.15, 0.18)
  Route2 0.127: v18.38,40.51 18.38,19.05 18.14,18.81 18.14,16.85 v18.23,16.76
  Route15 0.127: v21.92,13.45 21.83,13.45 19.96,15.32 19.68,15.32 v18.23,16.76
  Bottom 0.127: v21.92,13.45 21.92,11.87 22.62,11.18 22.62,8.38 22.43,8.19 22.43,6.48 J5.8
  Bottom 0.229: U17.24 18.38,40.15 v18.38,40.51
BUS0_GPIO0  (via drill 0.18, 0.25)
  Route2 0.127: v25.65,7.32 26.52,8.19 26.52,27.17 24.87,28.81 24.57,28.81 v23.08,30.3
  Bottom 0.127: U19.24 23.75,33.16 23.48,33.16 23.08,32.76 v23.08,30.3
  Bottom 0.152: J5.24 25.62,7.29 v25.65,7.32
BUS0_GPIO1  (via drill 0.18)
  Top 0.127: v18.86,3.61 18.74,3.61 CS2.TP
  Route2 0.152: v19.32,4.95 22.19,4.95 22.31,5.07 25.73,5.07 26.01,5.35 26.01,6.16 v27.22,7.37
  Route15 0.229: v19.32,4.95 18.86,4.5 v18.86,3.61
  Bottom 0.152: J5.32 v27.22,7.36 v27.22,7.37 | v19.32,4.95 19.32,5.29 19.35,5.32 19.35,5.76 19.23,5.88 18.88,5.88 U12.7
BUS0_SERCOM_P0  (via drill 0.18)
  Top 0.127: v22.24,2.87 19.91,2.87 MISO.TP
  Route2 0.127: v22.85,28.55 22.85,27.33 25.29,24.89 v25.29,16.84
  Route15 0.127: v25.29,16.84 25.29,14.48 25.6,14.18 25.6,10.72 22.04,7.16 22.04,4.46 22.24,4.26 v22.24,2.87
  Bottom 0.127: J5.7 22.42,3.04 v22.24,2.87 | U19.25 24.25,33.66 23.48,33.66 22.65,32.83 22.65,28.8 22.85,28.6 v22.85,28.55
  Bottom 0.152: U12.5 19.08,7.04 20.08,6.03 20.08,5.55 20.93,4.7 21.78,4.7 22.34,4.14 22.34,3.81 J5.7
BUS0_SERCOM_P1  (via drill 0.18)
  Top 0.127: v23.92,2.87 22.57,1.52 SCK.TP
  Route2 0.127: v26.13,9.58 26.13,14.37 24.91,15.59 v24.91,24.69
  Route15 0.127: v26.13,9.58 25.63,9.08 25.63,8.62 25.39,8.37 25.38,8.37 23.84,6.83 23.84,2.95 v23.92,2.87
  Bottom 0.127: J5.15 24.02,3.56 24.02,2.97 v23.92,2.87 | U19.26 24.97,34.25 24.97,34.52 24.86,34.63 24.09,34.63 22.24,32.78 22.24,27.36 v24.91,24.69
  Bottom 0.152: U12.4 19.08,7.54 20.36,6.25 20.36,5.66 21.05,4.98 21.41,4.98 21.47,5.04 23.45,5.04 23.68,4.81 23.68,4.64 24.02,4.3 24.02,3.56
BUS0_SERCOM_P2  (via drill 0.18)
  Top 0.127: v25.52,2.87 25.52,2.18 CS1.TP
  Route15 0.127: v25.52,2.87 25.52,3.98 26,4.46 26,7.13 27.7,8.83 27.7,14.97 23.28,19.39 v23.28,22.63
  Bottom 0.127: v25.52,2.87 25.52,3.31 25.52,3.32 25.52,3.63 J5.23 | U19.27 25.47,34.25 25.47,34.52 25.11,34.88 23.99,34.88 21.99,32.88 21.99,27.05 23.28,25.75 v23.28,22.63
BUS0_SERCOM_P3  (via drill 0.18)
  Top 0.127: v27.14,2.87 28.08,1.93 MOSI.TP
  Route15 0.127: v27.14,2.87 27.14,4.03 27.58,4.46 27.58,5.56 29.15,7.13 29.15,13.88 23.66,19.36 23.66,22.81 v21.73,24.74
  Bottom 0.127: v27.14,2.87 27.14,3.65 J5.31 | U19.28 25.97,34.25 25.97,34.52 25.35,35.14 23.88,35.14 21.73,32.99 v21.73,24.74
  Bottom 0.152: v27.14,2.87 26.25,2.87 24.55,1.17 21.1,1.17 19.81,2.46 19.81,5.82 19.08,6.54 U12.6
BUS1_AIN0
  Bottom 0.127: 20.65,15.43 22.31,13.78 22.31,12.6 22.88,12.03 22.88,6.48 J5.10
  Bottom 0.152: U2.1 18.24,15.42 20.64,15.42 20.65,15.43 21.23,16 R2.1
BUS1_GPIO0  (via drill 0.15, 0.18)
  Route2 0.127: v23.36,10.19 21.54,12 21.54,15.66 18.84,18.37 v18.84,25.32
  Bottom 0.127: v23.36,10.19 26.05,7.49 26.05,6.48 J5.26
  Bottom 0.229: U18.6 18.64,24.75 18.64,25.12 v18.84,25.32
BUS1_GPIO1  (via drill 0.15, 0.18)
  Route15 0.127: v28.16,8.71 v28.15,8.7 v28.15,7.37
  Bottom 0.127: v28.15,7.37 27.64,6.86 27.64,6.48 J5.34 | v28.16,8.71 28.16,8.88 23.36,13.69 23.36,17.98 22.54,18.8 20.69,18.8 17.73,21.77 17.73,27.71 16.11,29.32 U11.4
BUS1_SERCOM_P0  (via drill 0.18)
  Top 0.127: v22.8,2.87 22.78,2.87 22.4,2.49 21.43,2.49 SDA.TP
  Route15 0.127: v26.05,14.99 26.05,10.79 22.8,7.54 v22.8,2.87
  Bottom 0.127: J5.9 22.8,3.71 v22.8,2.87 22.8,2.09 R5.2 | U11.14 17.98,30.16 19.26,28.87 19.26,23.84 18.9,23.48 U18.7 18.62,23.22 17.98,22.58 17.98,21.88 20.8,19.06 22.64,19.06 23.64,18.06 23.64,17.4 v26.05,14.99
BUS1_SERCOM_P1  (via drill 0.18)
  Top 0.127: v24.43,2.87 24.3,2.74 24.3,2.71 24.27,2.69 SCL.TP
  Route15 0.127: v24.43,2.87 24.47,2.86 24.47,4.35 24.6,4.49 24.6,7.06 27.32,9.78 v27.32,14.25
  Bottom 0.127: U11.13 17.91,30.52 18.12,30.52 19.51,29.13 19.51,23.25 18.62,22.36 U18.8 18.62,21.78 21.09,19.31 22.77,19.31 23.92,18.16 23.92,17.67 27.32,14.27 v27.32,14.25 | v24.43,2.87 v24.42,2.88 J5.17
  Bottom 0.203: v24.43,2.87 24.65,2.65 R6.2
BUS2_AIN0  (via drill 0.18)
  Top 0.127: v22.42,5.51 J1.8
  Bottom 0.127: v22.42,5.51 22.82,5.92 23.01,5.92 23.22,6.12 J5.12
BUS2_AIN1  (via drill 0.18)
  Top 0.127: J1.16 24.02,5.72 v24.22,5.51
  Bottom 0.127: v24.22,5.51 24.22,5.53 24.82,6.12 J5.20
BUS2_GPIO0  (via drill 0.18)
  Top 0.127: v25.62,5.51 J1.24
  Bottom 0.127: v25.62,5.51 26.02,5.92 26.21,5.92 26.42,6.12 J5.28
BUS2_GPIO1  (via drill 0.18)
  Top 0.127: v27.2,5.51 27.2,6.38 J1.32
  Bottom 0.127: v27.2,5.51 27.6,5.92 27.81,5.92 28.02,6.12 J5.36
BUS2_SERCOM_P0  (via drill 0.18)
  Top 0.127: v22.42,4.62 J1.7
  Bottom 0.127: J5.11 23.22,4.13 22.73,4.62 v22.42,4.62
BUS2_SERCOM_P1  (via drill 0.18)
  Top 0.127: v24.22,4.65 24.02,4.44 J1.15
  Bottom 0.152: J5.19 24.74,3.81 24.74,4.14 v24.23,4.65 v24.22,4.65
BUS2_SERCOM_P2  (via drill 0.18)
  Top 0.127: v25.57,4.65 25.62,4.6 J1.23
  Bottom 0.127: J5.27 26.42,4.12 25.89,4.65 v25.57,4.65
BUS2_SERCOM_P3  (via drill 0.18)
  Top 0.127: v27.2,4.62 27.2,3.78 J1.31
  Bottom 0.127: v27.2,4.62 27.7,4.62 28.02,4.3 J5.35
BUS3_AIN0  (via drill 0.18)
  Top 0.127: v23.39,5.51 23.26,5.64 23.04,5.64 22.82,5.86 J1.10
  Bottom 0.127: v23.39,5.51 23.62,5.74 J5.14
BUS3_AIN1  (via drill 0.18)
  Top 0.127: v25.06,5.51 24.93,5.64 24.64,5.64 24.42,5.86 J1.18
  Bottom 0.127: v25.06,5.51 25.06,5.96 25.12,6.03 25.12,6.34 J5.22
BUS3_GPIO0  (via drill 0.18)
  Top 0.127: v26.66,5.51 26.53,5.64 26.24,5.64 26.02,5.86 J1.26
  Bottom 0.127: v26.66,5.51 26.66,5.96 26.72,6.03 26.72,6.34 J5.30
BUS3_GPIO1  (via drill 0.18)
  Top 0.127: v28.21,5.51 28.08,5.64 27.84,5.64 27.62,5.86 J1.34
  Bottom 0.127: v28.21,5.51 28.42,5.72 J5.38
BUS3_SERCOM_P0  (via drill 0.18)
  Top 0.127: v23.28,4.65 23.17,4.65 22.82,4.3 J1.9
  Bottom 0.127: v23.28,4.65 23.62,4.32 J5.13
BUS3_SERCOM_P1  (via drill 0.18)
  Top 0.127: v25.04,4.65 24.91,4.52 24.64,4.52 24.42,4.3 J1.17
  Bottom 0.127: J5.21 25.22,4.47 v25.04,4.65
BUS3_SERCOM_P2  (via drill 0.18)
  Top 0.127: v26.69,4.65 26.56,4.52 26.24,4.52 26.02,4.3 J1.25
  Bottom 0.127: J5.29 26.82,4.52 v26.69,4.65
BUS3_SERCOM_P3  (via drill 0.18)
  Top 0.127: v28.21,4.65 28.08,4.52 27.84,4.52 27.62,4.3 J1.33
  Bottom 0.127: J5.37 28.42,4.44 v28.21,4.65
CODEC_!RESET  (via drill 0.18)
  Top 0.127: v14.98,11.23 14.98,12.65 RESET.TP
  Bottom 0.127: R11.1 16.54,10.85 16.06,10.38 15.28,10.38 15.17,10.27 15.17,9.93 U12.26 15,11.21 v14.98,11.23
D_N
  Bottom 0.305: J7.D- 26.09,38.55 26.21,38.43 26.21,37.56 28.66,35.11 U19.33
D_P
  Bottom 0.305: J7.D+ 26.74,38.57 26.62,38.45 26.62,37.73 29.16,35.19 U19.34
DTR_DETECT_IN  (via drill 0.18)
  Top 0.127: v29.63,2.85 30.57,2.85 DIN.TP
  Route15 0.127: v20.29,41.07 32.78,28.58 32.78,5.99 v29.63,2.85
  Bottom 0.127: v29.63,2.85 29.27,3.2 29.02,3.2 28.82,3.41 J5.39 | U17.18 14.15,38.51 14.15,40.35 14.87,41.07 v20.29,41.07
DTR_DETECT_OUT  (via drill 0.18, 0.25)
  Top 0.127: DOUT.TP 29.99,1.78 28.82,2.95 J1.39 v28.82,2.74
  Route15 0.127: v15,40.41 14.98,40.39 14.98,37.29 13.56,35.87 13.56,7.09 18.64,2.01 28.1,2.02 v28.82,2.74
  Bottom 0.152: U17.19 14.88,40.28 v15,40.41
EN_BARO  (via drill 0.18)
  Top 0.127: U8.C2 15.71,27.38 v16.07,27.38 | v15.38,32.97 15.64,32.72 T7.TP
  Bottom 0.127: U17.11 v15.38,32.97 15.38,32.92 14.32,31.85 14.32,29.12 v16.06,27.38 v16.07,27.38
EN_CODEC  (via drill 0.18)
  Top 0.127: U14.C2 15,15.05 v15,17.6 | T2.TP 17.41,38.73 15.97,40.18 15.97,40.26 v15.77,40.46
  Route2 0.127: v15,17.6 15,39.06 15.74,39.8 15.74,40.44 v15.77,40.46
  Bottom 0.152: U17.21 15.89,40.34 v15.77,40.46
EN_IMU  (via drill 0.18)
  Top 0.127: U9.C2 17.09,26.59 v16.71,26.59 | v16.71,33.38 18.2,31.88 T8.TP
  Route2 0.127: v16.71,26.59 v16.71,33.38
  Bottom 0.127: U17.10 15.89,34.19 v16.71,33.38
EN_MEAS  (via drill 0.18)
  Top 0.127: EN.TP 31.89,5.49 v31.54,5.84
  Route15 0.127: v13.94,31.14 15.89,31.14 31.77,15.27 31.77,6.07 v31.54,5.84
  Bottom 0.127: U17.12 14.88,32.77 13.94,31.83 v13.94,31.14 | U13.1 32.01,5.37 v31.54,5.84
EN_MIC  (via drill 0.18)
  Top 0.127: T3.TP 17.74,38.04 18.38,38.04 v19.17,38.84
  Top 0.229: U10.C2 23,13.61 v22.85,13.46
  Route2 0.127: v19.17,38.84 19.17,38.81 19.68,38.3 19.68,18.39 22.85,15.21 v22.85,13.46
  Bottom 0.229: U17.1 18.47,38.84 v19.17,38.84
EN_RADIO  (via drill 0.18)
  Top 0.127: U7.C2 25.73,18.37 v25.67,18.31 | T11.TP 34.23,17.83 32.27,17.83 v30.45,16 31.27,15.18 31.27,13.48 32.05,12.7 U1.C2
  Route15 0.127: v25.67,18.31 28.14,18.31 v30.45,16
  Bottom 0.127: U17.7 17.47,35.24 20.3,32.41 20.3,23.68 v25.67,18.31
GND  (via drill 0.18, 0.25)  (1 unrouted)
  Top 0.127: C5.1 46.1,11.39 47.55,12.84 | L1.2
  Top 0.229: U9.C1 17.17,28.14 C22.2 | U8.C1 15.63,25.83 C20.2 | U10.C1 21.86,13.9 C24.2
  Top 0.5: L1.2 R28.1 47.55,14.5 47.55,12.84 47.69,12.69 49.71,12.69 50.02,13 A1.G1
  Bottom 0.229: 16.01,17.25 15.86,17.4 | U11.6 U11.7 15.9,31.11 15.41,31.11 | U19.42 31.02,30.97 31.36,30.97 31.68,31.29 C1.2 | U19.5 28.16,29.84 U19.THERMAL 27.16,30.34 U19.18 | U18.3 15.46,24.73 C48.2 | U17.25 16.4,37.47 U17.3 19.63,37.47 C13.1 | J5.1 21.22,2.9 21.25,2.87 21.47,3.09 | J5.3 21.62,3.24 21.47,3.09 | J5.5 21.47,3.17 21.47,3.09 | U15.2 14.83,14.57 C41.2 | U16.1 19.64,14.72 v19.83,14.91
  Bottom 0.254: 15.41,31.65 15.41,31.11
  Bottom 0.305: C42.2 19.79,14.12 U16.1
  other vias: 35.58,7.62 8.63,35.48 12.03,38.07 13.94,32.46 16.78,22.86 25.11,14.12 21.99,10.85 21.56,38.71 22.83,39.34 20.21,4.45 18.69,5.05 14.27,16.46 7.15,31.75 10.02,31.62 12.62,30.1 14.06,33.2 13.99,27.84 18.84,27.56 30.89,27.14 30.73,4.78 31.31,3.73 18.74,9.78 31.34,11.1 28.11,14.15 25.09,10.95 23.49,7.44 22.98,15.95 39.39,21.59 39.39,20.32 39.39,19.05 39.39,17.78 39.39,16.51 43.2,18.41 44.47,17.78 45.74,17.14 47.01,16.51 48.28,15.88 49.55,15.24 18.79,35.03 40.66,15.88 41.93,15.24 43.2,14.61 1.52,32.87 5.96,34.77 4.06,38.58 8.5,37.31 45.74,21.59 43.83,21.59 45.74,18.41
  pour Route2 (rank 2): -0.87,43.94 -0.87,0.64 0.53,-0.76 51.07,-0.76 51.07,2.92 50.82,3.17 50.82,3.81 40.66,3.81 40.66,13.97 50.82,13.97 51.07,43.94
  pour Route15 (rank 2): -1,44.45 -1,-1.02 -0.49,-1.52 50.77,-1.52 50.77,3.84 40.45,3.84 40.45,14.05 40.58,14.17 50.77,14.17 50.87,14.27 50.92,14.27 50.94,14.25 50.77,44.45
  pour Top (rank 2): -2.5,44.78 -2.5,-1.85 50.84,-1.85 50.84,3.76 40.64,3.76 40.64,14.15 43.86,14.15 43.83,14.1 47.01,14.1 45.69,14.94 45.48,14.61 44.73,15.03 44.85,15.44 43.96,16.13 44.34,16.94 48.07,14.83 48.07,14.07 50.92,14.07 50.92,44.78
  pour Bottom (rank 3): -1.89,46.35 -1.89,-2.54 53.36,-2.54 53.36,46.35
HPL
  Top 0.305: C31.2 9.89,1.27 13.35,1.27 13.5,1.42 J4.2
HPR
  Top 0.229: J4.3 6.57,9.63 C32.2
IN+
  Bottom 0.254: U2.3 17.35,18.26 R4.2 C8.1 16.06,19.33 R3.1
IN-
  Bottom 0.229: U2.4 20.23,18.36 R1.1 21.31,17.45 R2.2
LORA_CS  (via drill 0.18)
  Top 0.127: v25.3,27.85 24.16,27.85 22.49,29.52 U4.13P
  Bottom 0.127: v25.3,27.85 25.16,27.7 U19.11
LORA_IRQ0  (via drill 0.18)
  Top 0.127: v24.64,28.43 29.73,33.52 U4.6P
  Bottom 0.127: U19.14 24.02,28.43 v24.64,28.43
LORA_IRQ1  (via drill 0.18)
  Top 0.127: v26.8,33.33 28.98,35.52 U4.7P
  Bottom 0.152: U19.29 26.66,33.5 26.66,33.47 v26.8,33.33
LORA_MISO  (via drill 0.18)
  Top 0.127: v24.66,31.91 24.66,33.42 22.55,35.53 21.93,35.53 U4.10P
  Bottom 0.127: v24.66,31.91 24,31.91 U19.21
LORA_MOSI  (via drill 0.18)
  Top 0.127: v24.66,30.89 24.54,31.02 24.51,31.02 22.01,33.52 U4.11P
  Bottom 0.127: v24.66,30.89 23.99,30.89 U19.19
LORA_RST  (via drill 0.25)
  Top 0.127: v23.92,27.3 22.13,27.3 U4.14P
  Bottom 0.127: U19.13 23.93,27.32 v23.92,27.3
LORA_SCK  (via drill 0.18)
  Top 0.127: v24.66,31.4 24.79,31.28 24.82,31.28 25.04,31.05 25.04,30.74 24.82,30.51 23.48,30.51 22.47,31.52 U4.12P
  Bottom 0.127: v24.66,31.4 23.99,31.4 U19.20
MASTER_I2C_SCL  (via drill 0.18, 0.25)
  Top 0.127: v28.77,7.29 29.15,7.67 32.91,7.67 ASCL.TP
  Top 0.229: J1.40 28.82,7.24 v28.77,7.29
  Route2 0.127: v25.21,9.04 25.2,9.05 20.34,9.05 13.53,15.87 13.53,37.06 13.21,37.39 13.15,37.39 v12.92,37.62
  Bottom 0.127: U17.16 13.07,37.47 v12.92,37.62 | v28.77,7.29 27.02,9.04 v25.21,9.04
  Bottom 0.254: J5.40 28.79,6.47 28.79,6.87 28.77,6.89 v28.77,7.29
MASTER_I2C_SDA  (via drill 0.18)
  Top 0.127: v29.23,5.51 30.78,5.51 31.52,4.77 32.96,4.77 33.67,5.49 ASDA.TP
  Top 0.229: J1.42 v29.23,5.51
  Route2 0.127: v13.05,37.01 13.05,14.57 18.19,9.42 18.19,5.01 19.2,4 25.46,4 26.53,5.07 28.78,5.07 v29.23,5.51
  Bottom 0.127: U17.15 13.1,36.96 v13.05,37.01
  Bottom 0.254: J5.42 29.23,6.42 v29.23,5.51
MEAS_BARO  (via drill 0.18)
  Top 0.127: 14.62,21.08 U5.8 | T5.TP 15.92,34.44 v16.5,34.44
  Top 0.305: v15.69,21.08 14.62,21.08
  Route2 0.127: v15.69,21.08 15.69,21.76 16.32,22.39 16.32,26.75 16.45,26.88 16.45,27.54 16.32,27.67 16.32,33.53 16.5,33.71 v16.5,34.44
  Bottom 0.127: U17.9 16.5,35.14 v16.5,34.44
MEAS_CODEC  (via drill 0.18)
  Top 0.127: T1.TP 15.36,39.27 v15.36,39.95 | U3.4 20.37,11.49 v20.49,11.61
  Route2 0.127: v15.36,39.95 14.62,39.22 14.62,17.44 20.46,11.61 v20.49,11.61
  Bottom 0.152: U17.20 15.38,39.93 v15.36,39.95
MEAS_IMU  (via drill 0.18)
  Top 0.127: v17.47,21.49 17.85,21.49 17.94,21.58 U5.4 | v17.47,34.49 17.98,34.49 T6.TP
  Route2 0.127: v17.47,34.49 v17.47,21.49
  Bottom 0.127: U17.8 17.12,35.03 17.12,34.76 17.24,34.65 17.31,34.65 v17.47,34.49
MEAS_MIC  (via drill 0.18)
  Top 0.127: U3.8 22.37,11.99 v22.34,12.01 | T4.TP 17.8,36.66 19.24,38.1 v19.3,38.1
  Route2 0.127: v22.34,12.01 22.32,12.04 22.32,15.25 19.27,18.3 19.27,38.08 v19.3,38.1
  Bottom 0.229: U17.2 18.24,38.1 v19.3,38.1
MEAS_RFM  (via drill 0.18)
  Top 0.127: T9.TP 32.4,18.54 29.68,15.82 29.68,13.79 U6.8 29.74,15.67 v29.79,15.67
  Bottom 0.127: U17.5 18.42,36.45 20.85,34.02 20.85,24.53 29.7,15.67 v29.79,15.67
MEAS_SAMD  (via drill 0.18)
  Top 0.127: U6.4 30.24,11.49 v30.17,11.56 | v35.86,17.7 36.7,18.54 T10.TP
  Bottom 0.127: U17.6 18.45,35.94 20.59,33.8 20.59,24.3 30.14,14.75 33.08,14.75 | 33.08,14.75 30.62,12.29 30.62,12.01 v30.17,11.56 | 33.08,14.75 35.86,17.53
  Bottom 0.203: 35.86,17.53 v35.86,17.7
MICBIAS
  Bottom 0.305: R8.1 18,3.65 U12.9
MICIN  (via drill 0.25)
  Top 0.254: v3.19,3.81 1.3,1.92 J4.1
  Bottom 0.152: C33.2 16.35,2.93 16.15,3.13 11.31,3.13 10.63,3.81 v3.19,3.81
  Bottom 0.305: C33.2 17.87,2.02 R8.2
N$1
  Bottom 0.229: U19.43 31.9,30.34 C1.1
N$2
  Top 0.61: SJ3.3 46.69,20.21 X4.3
N$3  (via drill 0.25)
  Route15 0.229: v13.99,34.01 16.79,36.82 16.79,42.89 J2.5
  Bottom 0.229: SJ1.3 13.1,34.01 v13.99,34.01
N$4
  Top 0.127: C5.2 47.81,5.04 48.02,4.84 A1.G2 49.97,4.84 C3.2
N$5
  Bottom 0.229: U19.1 31.76,25.51 X2.P$1 31.99,23.82 C2.1
N$6
  Bottom 0.229: C6.2 R1.2
N$7
  Bottom 0.229: U19.2 29.66,25.58 X2.P$2
  Bottom 0.254: C4.1 X2.P$2
N$8  (via drill 0.25)
  Top 0.305: JP13.1 20.39,7.59 v20.31,7.52
  Bottom 0.229: R_SENSE.2 20.7,7.52 v20.31,7.52
N$9
  Top 0.61: SJ3.1 41.33,18.2 C26.1
N$10
  Bottom 0.229: C48.1 16.47,23.63 U18.2
N$11
  Top 0.305: R7.1 4.41,33.6 X6.3
N$12  (via drill 0.25)
  Top 0.127: SW1.4 SW1.2 7.57,33.03 v7.56,33.02
  Bottom 0.127: R9.1 7.56,33.31 v7.56,33.02
N$13
  Top 0.5: L1.1 R27.1 C26.2
N$15  (via drill 0.18)
  Top 0.305: v13.02,7.62 12.02,6.62 11.68,6.62 8.28,3.22 C31.1
  Bottom 0.229: U12.21 13.1,7.54 v13.02,7.62
N$17  (via drill 0.25)
  Top 0.229: v23.59,40.51 22.12,40.51 USBV.TP
  Bottom 0.229: J7.VBUS 24.87,40.51 v23.59,40.51
N$18
  Bottom 0.229: SJ1.2 12.51,34.24 12.51,34.72 12.66,34.86 13.1,34.86 U17.13
N$19
  Bottom 0.229: SJ2.2 14.08,36.55 U17.14
N$20
  Bottom 0.152: SJ2.3 11.92,37.35 13.58,39.01 13.58,42.21 J2.4
N$22
  Bottom 0.229: SJ1.1 11.38,34.05 X1.P$1 9.72,33.33 9.62,33.23 9.62,33.17 C16.2
N$23
  Bottom 0.229: C15.2 9.22,36.96 X1.P$2 10.43,36.45 10.89,35.99 11.37,35.99 SJ2.1
N$25  (via drill 0.18)
  Top 0.254: v14.55,10.52 13.66,9.63 C32.1
  Bottom 0.254: U12.25 14.5,10.47 v14.55,10.52
N$26
  Top 0.61: U4.1P 39.33,22.3 41.85,22.3 42.85,21.3 SJ3.2
N$27
  Bottom 0.305: U12.10 17.5,4.36 17.25,4.11 17.24,4.11 C33.1
OUT  (via drill 0.18)
  Top 0.229: v22.88,16.46 23.72,16.46 MK1.1
  Bottom 0.229: C6.1 v22.87,16.47 v22.88,16.46
SAMD_!RESET  (via drill 0.18)
  Top 0.229: SW2.4 25.74,21.37 31.84,27.48 v31.84,32.36 | v36.97,11.96 36.97,11.46 J3.10
  Top 0.254: SW2.2 SW2.4
  Bottom 0.229: U19.40 31.32,31.84 v31.84,32.36 31.86,32.38 33.48,32.38 36.97,28.89 v36.97,11.97 v36.97,11.96
SWCLK  (via drill 0.18, 0.25)
  Top 0.229: J3.4 38.35,12.83 v38.22,12.95
  Route2 0.229: v38.22,12.95 38.22,21.28 v30.1,29.4
  Bottom 0.127: U19.45 30.16,29.34 v30.1,29.4
SWDIO  (via drill 0.18, 0.25)
  Top 0.229: J3.2 39.34,14.02 v37.74,14.02
  Route2 0.229: v37.74,14.02 37.74,21.12 v30.07,28.79
  Bottom 0.127: U19.46 30.13,28.84 v30.07,28.79
V_SENSE_IN  (via drill 0.18)
  Top 0.127: v34.84,6.33 34.84,6.17 34.79,6.12 34.79,5.2 32.84,3.25 JP16.2 30.13,3.25 J1.43
  Bottom 0.127: U13.4 34.28,6.72 34.38,6.72 34.81,6.29 v34.84,6.33
V_SENSE_OUT
  Bottom 0.127: U13.5 34.12,6.02 32.34,4.25 29.84,4.25 29.73,4.13 29.73,3.83 J5.43

## Text on the board
tPlace: SAMD PROG | ADEBUG | O | S | AT RESET | L | SAMD RESET | U.Fl | SAMD DEBUG
bPlace: ATTINY817 | SAMD21 | IMU | MPL3115 | CommonSense Daughter Board v1 / Eve Hu 7/2/2020